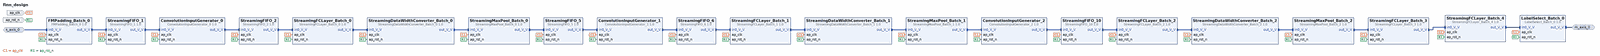
[diagram p0: block diagram of the top level, whole]
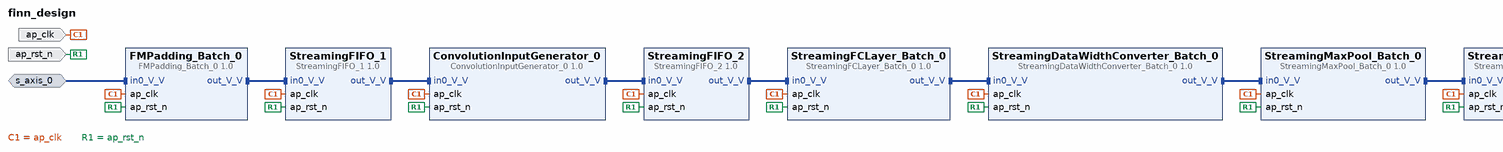
[diagram p1: block diagram of the top level, left part]
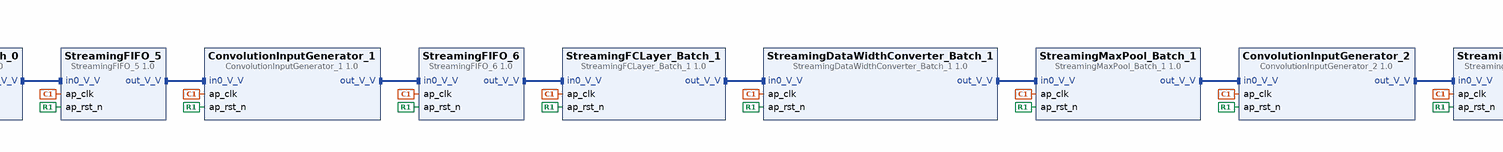
[diagram p2: block diagram of the top level, centre part]
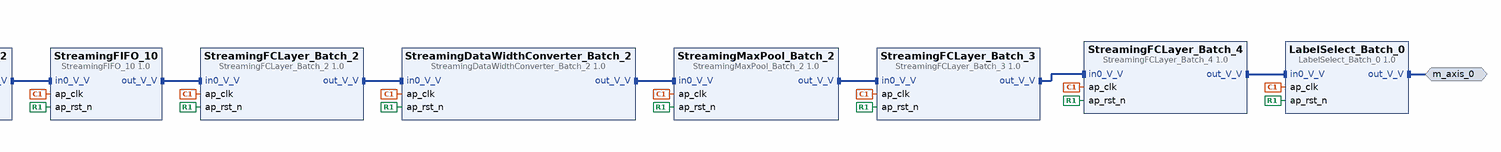
[diagram p3: block diagram of the top level, right part]
# Vivado block design finn_design, xc7a100tfgg484-1, Vivado 2020.1
create_bd_design finn_design

create_bd_intf_port -mode Slave -vlnv xilinx.com:interface:axis_rtl:1.0 s_axis_0
set_property -dict [list \
  CONFIG.TDATA_NUM_BYTES 1 \
  CONFIG.TDEST_WIDTH 0 \
  CONFIG.TID_WIDTH 0 \
  CONFIG.TUSER_WIDTH 0 \
  CONFIG.HAS_TREADY 1 \
  CONFIG.HAS_TSTRB 0 \
  CONFIG.HAS_TKEEP 0 \
  CONFIG.HAS_TLAST 0 \
  CONFIG.FREQ_HZ 50000000.000000 \
  CONFIG.LAYERED_METADATA undef \
] [get_bd_intf_ports s_axis_0]
create_bd_intf_port -mode Master -vlnv xilinx.com:interface:axis_rtl:1.0 m_axis_0
set_property -dict {CONFIG.FREQ_HZ 50000000.000000} [get_bd_intf_ports m_axis_0]
create_bd_port -dir I -type clk ap_clk
set_property -dict {CONFIG.FREQ_HZ 50000000.000000} [get_bd_ports ap_clk]
create_bd_port -dir I -type rst ap_rst_n

create_bd_cell -type ip -vlnv xilinx.com:hls:FMPadding_Batch_0:1.0 FMPadding_Batch_0
create_bd_cell -type ip -vlnv xilinx.com:hls:StreamingFIFO_1:1.0 StreamingFIFO_1
create_bd_cell -type ip -vlnv xilinx.com:hls:ConvolutionInputGenerator_0:1.0 ConvolutionInputGenerator_0
create_bd_cell -type ip -vlnv xilinx.com:hls:StreamingFIFO_2:1.0 StreamingFIFO_2
create_bd_cell -type ip -vlnv xilinx.com:hls:StreamingFCLayer_Batch_0:1.0 StreamingFCLayer_Batch_0
create_bd_cell -type ip -vlnv xilinx.com:hls:StreamingDataWidthConverter_Batch_0:1.0 StreamingDataWidthConverter_Batch_0
create_bd_cell -type ip -vlnv xilinx.com:hls:StreamingMaxPool_Batch_0:1.0 StreamingMaxPool_Batch_0
create_bd_cell -type ip -vlnv xilinx.com:hls:StreamingFIFO_5:1.0 StreamingFIFO_5
create_bd_cell -type ip -vlnv xilinx.com:hls:ConvolutionInputGenerator_1:1.0 ConvolutionInputGenerator_1
create_bd_cell -type ip -vlnv xilinx.com:hls:StreamingFIFO_6:1.0 StreamingFIFO_6
create_bd_cell -type ip -vlnv xilinx.com:hls:StreamingFCLayer_Batch_1:1.0 StreamingFCLayer_Batch_1
create_bd_cell -type ip -vlnv xilinx.com:hls:StreamingDataWidthConverter_Batch_1:1.0 StreamingDataWidthConverter_Batch_1
create_bd_cell -type ip -vlnv xilinx.com:hls:StreamingMaxPool_Batch_1:1.0 StreamingMaxPool_Batch_1
create_bd_cell -type ip -vlnv xilinx.com:hls:ConvolutionInputGenerator_2:1.0 ConvolutionInputGenerator_2
create_bd_cell -type ip -vlnv xilinx.com:hls:StreamingFIFO_10:1.0 StreamingFIFO_10
create_bd_cell -type ip -vlnv xilinx.com:hls:StreamingFCLayer_Batch_2:1.0 StreamingFCLayer_Batch_2
create_bd_cell -type ip -vlnv xilinx.com:hls:StreamingDataWidthConverter_Batch_2:1.0 StreamingDataWidthConverter_Batch_2
create_bd_cell -type ip -vlnv xilinx.com:hls:StreamingMaxPool_Batch_2:1.0 StreamingMaxPool_Batch_2
create_bd_cell -type ip -vlnv xilinx.com:hls:StreamingFCLayer_Batch_3:1.0 StreamingFCLayer_Batch_3
create_bd_cell -type ip -vlnv xilinx.com:hls:StreamingFCLayer_Batch_4:1.0 StreamingFCLayer_Batch_4
create_bd_cell -type ip -vlnv xilinx.com:hls:LabelSelect_Batch_0:1.0 LabelSelect_Batch_0

# ---- connections ----

connect_bd_intf_net [get_bd_intf_pins StreamingFCLayer_Batch_2/out_V_V] [get_bd_intf_pins StreamingDataWidthConverter_Batch_2/in0_V_V]
connect_bd_intf_net -intf_net in0_V_V_0_1 [get_bd_intf_ports s_axis_0] [get_bd_intf_pins FMPadding_Batch_0/in0_V_V]
connect_bd_intf_net [get_bd_intf_pins FMPadding_Batch_0/out_V_V] [get_bd_intf_pins StreamingFIFO_1/in0_V_V]
connect_bd_intf_net [get_bd_intf_pins StreamingFIFO_1/out_V_V] [get_bd_intf_pins ConvolutionInputGenerator_0/in0_V_V]
connect_bd_intf_net [get_bd_intf_pins ConvolutionInputGenerator_0/out_V_V] [get_bd_intf_pins StreamingFIFO_2/in0_V_V]
connect_bd_intf_net [get_bd_intf_pins StreamingFIFO_2/out_V_V] [get_bd_intf_pins StreamingFCLayer_Batch_0/in0_V_V]
connect_bd_intf_net [get_bd_intf_pins StreamingFCLayer_Batch_0/out_V_V] [get_bd_intf_pins StreamingDataWidthConverter_Batch_0/in0_V_V]
connect_bd_intf_net [get_bd_intf_pins StreamingDataWidthConverter_Batch_0/out_V_V] [get_bd_intf_pins StreamingMaxPool_Batch_0/in0_V_V]
connect_bd_intf_net [get_bd_intf_pins StreamingMaxPool_Batch_0/out_V_V] [get_bd_intf_pins StreamingFIFO_5/in0_V_V]
connect_bd_intf_net [get_bd_intf_pins StreamingFIFO_5/out_V_V] [get_bd_intf_pins ConvolutionInputGenerator_1/in0_V_V]
connect_bd_intf_net [get_bd_intf_pins ConvolutionInputGenerator_1/out_V_V] [get_bd_intf_pins StreamingFIFO_6/in0_V_V]
connect_bd_intf_net [get_bd_intf_pins StreamingFIFO_6/out_V_V] [get_bd_intf_pins StreamingFCLayer_Batch_1/in0_V_V]
connect_bd_intf_net [get_bd_intf_pins StreamingFCLayer_Batch_1/out_V_V] [get_bd_intf_pins StreamingDataWidthConverter_Batch_1/in0_V_V]
connect_bd_intf_net [get_bd_intf_pins StreamingDataWidthConverter_Batch_1/out_V_V] [get_bd_intf_pins StreamingMaxPool_Batch_1/in0_V_V]
connect_bd_intf_net [get_bd_intf_pins StreamingMaxPool_Batch_1/out_V_V] [get_bd_intf_pins ConvolutionInputGenerator_2/in0_V_V]
connect_bd_intf_net [get_bd_intf_pins ConvolutionInputGenerator_2/out_V_V] [get_bd_intf_pins StreamingFIFO_10/in0_V_V]
connect_bd_intf_net [get_bd_intf_pins StreamingFIFO_10/out_V_V] [get_bd_intf_pins StreamingFCLayer_Batch_2/in0_V_V]
connect_bd_intf_net [get_bd_intf_pins StreamingDataWidthConverter_Batch_2/out_V_V] [get_bd_intf_pins StreamingMaxPool_Batch_2/in0_V_V]
connect_bd_intf_net [get_bd_intf_pins StreamingMaxPool_Batch_2/out_V_V] [get_bd_intf_pins StreamingFCLayer_Batch_3/in0_V_V]
connect_bd_intf_net [get_bd_intf_pins StreamingFCLayer_Batch_3/out_V_V] [get_bd_intf_pins StreamingFCLayer_Batch_4/in0_V_V]
connect_bd_intf_net [get_bd_intf_pins StreamingFCLayer_Batch_4/out_V_V] [get_bd_intf_pins LabelSelect_Batch_0/in0_V_V]
connect_bd_intf_net [get_bd_intf_ports m_axis_0] [get_bd_intf_pins LabelSelect_Batch_0/out_V_V]
connect_bd_net -net ap_clk_0_1 [get_bd_ports ap_clk] \
  [get_bd_pins FMPadding_Batch_0/ap_clk] [get_bd_pins StreamingFIFO_1/ap_clk] \
  [get_bd_pins ConvolutionInputGenerator_0/ap_clk] [get_bd_pins StreamingFIFO_2/ap_clk] \
  [get_bd_pins StreamingFCLayer_Batch_0/ap_clk] [get_bd_pins StreamingDataWidthConverter_Batch_0/ap_clk] \
  [get_bd_pins StreamingMaxPool_Batch_0/ap_clk] [get_bd_pins StreamingFIFO_5/ap_clk] \
  [get_bd_pins ConvolutionInputGenerator_1/ap_clk] [get_bd_pins StreamingFIFO_6/ap_clk] \
  [get_bd_pins StreamingFCLayer_Batch_1/ap_clk] [get_bd_pins StreamingDataWidthConverter_Batch_1/ap_clk] \
  [get_bd_pins StreamingMaxPool_Batch_1/ap_clk] [get_bd_pins ConvolutionInputGenerator_2/ap_clk] \
  [get_bd_pins StreamingFIFO_10/ap_clk] [get_bd_pins StreamingFCLayer_Batch_2/ap_clk] \
  [get_bd_pins StreamingDataWidthConverter_Batch_2/ap_clk] [get_bd_pins StreamingMaxPool_Batch_2/ap_clk] \
  [get_bd_pins StreamingFCLayer_Batch_3/ap_clk] [get_bd_pins StreamingFCLayer_Batch_4/ap_clk] \
  [get_bd_pins LabelSelect_Batch_0/ap_clk]
connect_bd_net -net ap_rst_n_0_1 [get_bd_ports ap_rst_n] \
  [get_bd_pins FMPadding_Batch_0/ap_rst_n] [get_bd_pins StreamingFIFO_1/ap_rst_n] \
  [get_bd_pins ConvolutionInputGenerator_0/ap_rst_n] [get_bd_pins StreamingFIFO_2/ap_rst_n] \
  [get_bd_pins StreamingFCLayer_Batch_0/ap_rst_n] [get_bd_pins StreamingDataWidthConverter_Batch_0/ap_rst_n] \
  [get_bd_pins StreamingMaxPool_Batch_0/ap_rst_n] [get_bd_pins StreamingFIFO_5/ap_rst_n] \
  [get_bd_pins ConvolutionInputGenerator_1/ap_rst_n] [get_bd_pins StreamingFIFO_6/ap_rst_n] \
  [get_bd_pins StreamingFCLayer_Batch_1/ap_rst_n] [get_bd_pins StreamingDataWidthConverter_Batch_1/ap_rst_n] \
  [get_bd_pins StreamingMaxPool_Batch_1/ap_rst_n] [get_bd_pins ConvolutionInputGenerator_2/ap_rst_n] \
  [get_bd_pins StreamingFIFO_10/ap_rst_n] [get_bd_pins StreamingFCLayer_Batch_2/ap_rst_n] \
  [get_bd_pins StreamingDataWidthConverter_Batch_2/ap_rst_n] [get_bd_pins StreamingMaxPool_Batch_2/ap_rst_n] \
  [get_bd_pins StreamingFCLayer_Batch_3/ap_rst_n] [get_bd_pins StreamingFCLayer_Batch_4/ap_rst_n] \
  [get_bd_pins LabelSelect_Batch_0/ap_rst_n]

validate_bd_design
save_bd_design
